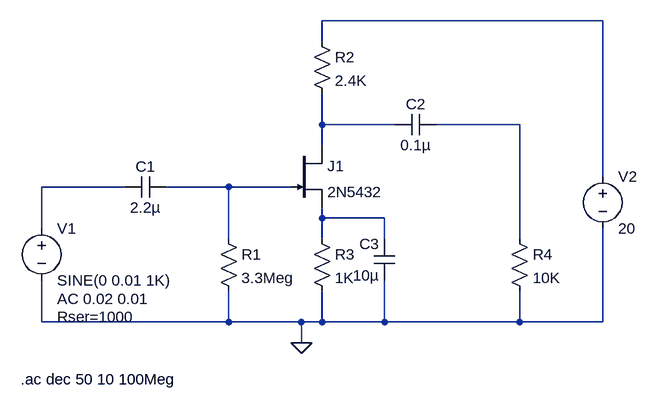
[diagram p0: schematic Expt 7.asc]
Expt 7.asc, the LTspice schematic file:
Version 4.1
SHEET 1 888 680
WIRE 832 -96 400 -96
WIRE 400 -64 400 -96
WIRE 400 64 400 16
WIRE 512 64 400 64
WIRE 704 64 576 64
WIRE 400 96 400 64
WIRE 832 144 832 -96
WIRE 96 160 -32 160
WIRE 256 160 160 160
WIRE 352 160 256 160
WIRE 400 208 400 192
WIRE 496 208 400 208
WIRE -32 224 -32 160
WIRE 256 240 256 160
WIRE 400 240 400 208
WIRE 496 240 496 208
WIRE 704 240 704 64
WIRE -32 368 -32 304
WIRE 256 368 256 320
WIRE 256 368 -32 368
WIRE 368 368 256 368
WIRE 400 368 400 320
WIRE 400 368 368 368
WIRE 496 368 496 304
WIRE 496 368 400 368
WIRE 704 368 704 320
WIRE 704 368 496 368
WIRE 832 368 832 224
WIRE 832 368 704 368
WIRE 368 400 368 368
FLAG 368 400 0
SYMBOL voltage -32 208 R0
WINDOW 123 24 124 Left 2
WINDOW 39 24 152 Left 2
SYMATTR InstName V1
SYMATTR Value SINE(0 0.01 1K)
SYMATTR Value2 AC 0.02 0.01
SYMATTR SpiceLine Rser=1000
SYMBOL voltage 832 128 R0
WINDOW 123 0 0 Left 0
WINDOW 39 0 0 Left 0
SYMATTR InstName V2
SYMATTR Value 20
SYMBOL njf 352 96 R0
SYMATTR InstName J1
SYMATTR Value 2N5432
SYMBOL cap 160 144 R90
WINDOW 0 0 32 VBottom 2
WINDOW 3 32 32 VTop 2
SYMATTR InstName C1
SYMATTR Value 2.2µ
SYMBOL cap 576 48 R90
WINDOW 0 0 32 VBottom 2
WINDOW 3 32 32 VTop 2
SYMATTR InstName C2
SYMATTR Value 0.1µ
SYMBOL cap 512 304 R180
WINDOW 0 24 56 Left 2
WINDOW 3 24 8 Left 2
SYMATTR InstName C3
SYMATTR Value 10µ
SYMBOL res 240 224 R0
SYMATTR InstName R1
SYMATTR Value 3.3Meg
SYMBOL res 384 -80 R0
SYMATTR InstName R2
SYMATTR Value 2.4K
SYMBOL res 384 224 R0
SYMATTR InstName R3
SYMATTR Value 1K
SYMBOL res 688 224 R0
SYMATTR InstName R4
SYMATTR Value 10K
TEXT -64 456 Left 2 !.ac dec 50 10 100Meg

The netlist it stands for:
* Expt 7.asc
V1 N004 0 SINE(0 0.01 1K) AC 0.02 0.01 Rser=1000
V2 N001 0 20
J1 N002 N005 N006 2N5432
C1 N005 N004 2.2µ
C2 N003 N002 0.1µ
C3 0 N006 10µ
R1 N005 0 3.3Meg
R2 N001 N002 2.4K
R3 N006 0 1K
R4 N003 0 10K
.model NJF NJF
.model PJF PJF
.lib standard.jft
.ac dec 50 10 100Meg
.backanno
.end